# Altium schematic sheet 04_ALTIMETER.SchDoc
size A4; Author: Gabriel; Organization: Altium Limited; Address1: L3, 12a Rodborough Rd; Address2: Frenchs Forest; Address3: NSW; Address4: Australia 2086; SheetNumber: 1; SheetTotal: 1
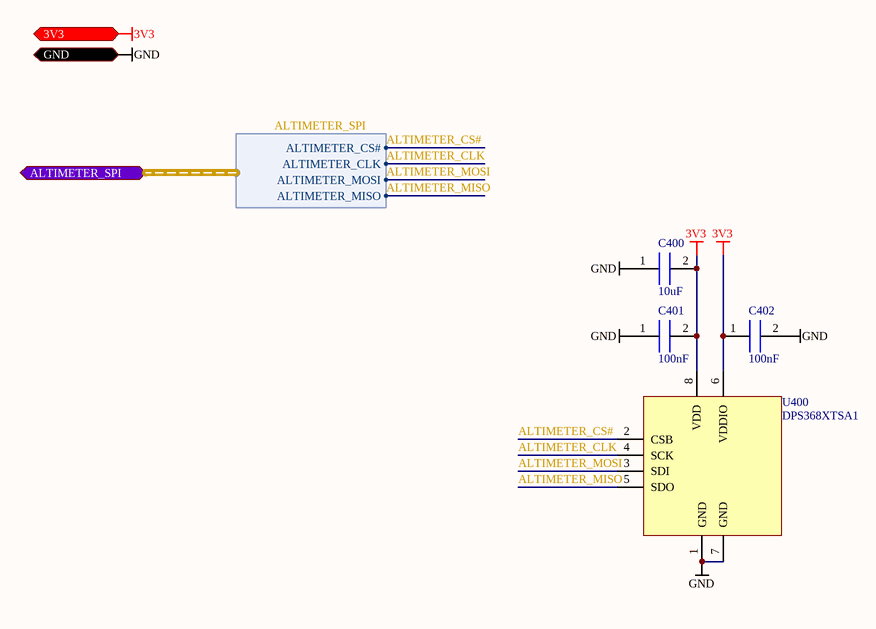
[diagram p0: 04_ALTIMETER.SchDoc]

## Parts
C400  value 10uF  [CAP_0402]  (hidden comment: 10uF_20%_6.3V_0402_GRM155R60J106ME05D)
C401  value 100nF  [CAP_0402]  (hidden comment: 100nF_10%_16V_0402_GRM155R71C104KA88J)
C402  value 100nF  [CAP_0402]  (hidden comment: 100nF_10%_16V_0402_GRM155R71C104KA88J)
U400  MANUFACTURER REFERENCE: DPS368XTSA1  (hidden comment: BAR_4V_0.002hPA_500nA_DPS368XTSA1)

## Ports
3V3 (in), ALTIMETER_SPI (harness ALTIMETER_SPI), GND (in)

## Harnesses
ALTIMETER_SPI: ALTIMETER_MISO, ALTIMETER_MOSI, ALTIMETER_CLK, ALTIMETER_CS#

## Nets
3V3: C400.2 C401.2 C402.1 U400.6(VDDIO) U400.8(VDD) ; port 3V3
GND: C400.1 C401.1 C402.2 U400.1(GND) U400.7(GND) ; port GND
ALTIMETER_CLK: U400.4(SCK) ; port ALTIMETER_SPI.ALTIMETER_CLK
ALTIMETER_CS#: U400.2(CSB) ; port ALTIMETER_SPI.ALTIMETER_CS#
ALTIMETER_MISO: U400.5(SDO) ; port ALTIMETER_SPI.ALTIMETER_MISO
ALTIMETER_MOSI: U400.3(SDI) ; port ALTIMETER_SPI.ALTIMETER_MOSI

## Notes on the sheet
- TITLE:
- CREATED BY
- MODIFIED DATE
- PAGE
- /

## Library data of the parts
C400 = 10uF 20% 6.3V 0402 GRM155R60J106ME05D: CAPACITOR 10uF 20% 6.3V 0402 GRM155R60J106ME05D; MANUFACTURER: MURATA; DIELECTRIC: X5R; TOLERANCE: 20%; VOLTAGE RATING: 6.3V; PACKAGING: 0402; MOUNTING: SMD; MANUFACTURER REFERENCE: GRM155R60J106ME05D
C401 C402 = 100nF_10%_16V_0402_GRM155R71C104KA88J: CAPACITOR 100nF 10% X7R 0402; MANUFACTURER: MURATA; DIELECTRIC: X5R; VOLTAGE RATING: 16V; TOLERANCE: 10%; MOUNTING: SMD; MANUFACTURER REFERENCE: GRM155R71C104KA88J; PACKAGING: 0402
U400 = BAR_4V_0.002hPA_500nA_DPS368XTSA1: BAROMETRIC SENSOR 4V 0.002hPA 500nA DPS368XTSA1; MANUFACTURER: INFINEON; INPUT VOLTAGE MIN: 1.7V; CURRENT MAX: 350uA; NUMBER OF GATES: 1; INPUT VOLTAGE MAX: 4V; PACKAGING: 8-VFLGA; MOUNTING: SMD